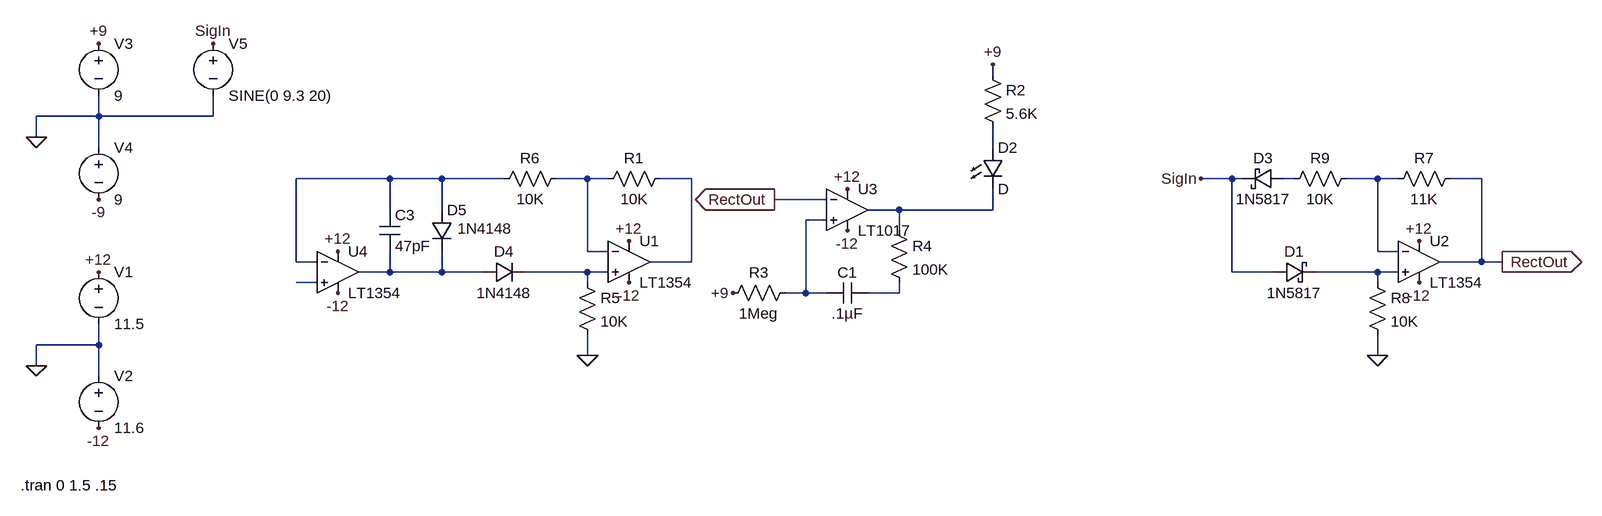
[diagram p0: schematic clip_detector.asc]
clip_detector.asc, the LTspice schematic file:
Version 4
SHEET 1 2008 1044
WIRE 1072 160 1072 144
WIRE -304 224 -304 192
WIRE -304 224 -400 224
WIRE -128 224 -128 192
WIRE -128 224 -304 224
WIRE -400 256 -400 224
WIRE -304 272 -304 224
WIRE 1072 272 1072 240
WIRE 144 320 0 320
WIRE 224 320 144 320
WIRE 320 320 224 320
WIRE 448 320 400 320
WIRE 480 320 448 320
WIRE 608 320 560 320
WIRE 1440 320 1392 320
WIRE 1456 320 1440 320
WIRE 1536 320 1520 320
WIRE 1664 320 1616 320
WIRE 1696 320 1664 320
WIRE 1824 320 1776 320
WIRE 816 352 736 352
WIRE 144 368 144 320
WIRE 224 368 224 320
WIRE 928 368 880 368
WIRE 1072 368 1072 336
WIRE 1072 368 928 368
WIRE 816 384 784 384
WIRE 928 400 928 368
WIRE 448 432 448 320
WIRE 480 432 448 432
WIRE 1664 432 1664 320
WIRE 1696 432 1664 432
WIRE 0 448 0 320
WIRE 32 448 0 448
WIRE 608 448 608 320
WIRE 608 448 544 448
WIRE 1824 448 1824 320
WIRE 1824 448 1760 448
WIRE 1856 448 1824 448
WIRE 144 464 144 432
WIRE 144 464 96 464
WIRE 224 464 224 432
WIRE 224 464 144 464
WIRE 288 464 224 464
WIRE 448 464 352 464
WIRE 480 464 448 464
WIRE 1440 464 1440 320
WIRE 1504 464 1440 464
WIRE 1664 464 1568 464
WIRE 1696 464 1664 464
WIRE 32 480 0 480
WIRE 448 480 448 464
WIRE 1664 480 1664 464
WIRE 784 496 784 384
WIRE 784 496 752 496
WIRE 816 496 784 496
WIRE 928 496 928 480
WIRE 928 496 880 496
WIRE -304 576 -304 544
WIRE -304 576 -400 576
WIRE 448 592 448 560
WIRE 1664 592 1664 560
WIRE -400 608 -400 576
WIRE -304 624 -304 576
FLAG -400 608 0
FLAG -304 464 +12
FLAG -304 704 -12
FLAG 848 336 +12
FLAG 848 400 -12
FLAG -400 256 0
FLAG -304 112 +9
FLAG -304 352 -9
FLAG -128 112 SigIn
FLAG 672 496 +9
FLAG 1072 144 +9
FLAG 512 416 +12
FLAG 512 480 -12
FLAG 448 592 0
FLAG 64 432 +12
FLAG 64 496 -12
FLAG 1728 416 +12
FLAG 1728 480 -12
FLAG 1664 592 0
FLAG 1392 320 SigIn
FLAG 1856 448 RectOut
IOPIN 1856 448 Out
FLAG 736 352 RectOut
IOPIN 736 352 Out
SYMBOL voltage -304 448 R0
WINDOW 123 0 0 Left 0
WINDOW 39 0 0 Left 0
SYMATTR InstName V1
SYMATTR Value 11.5
SYMBOL voltage -304 608 R0
WINDOW 123 0 0 Left 0
WINDOW 39 0 0 Left 0
SYMATTR InstName V2
SYMATTR Value 11.6
SYMBOL cap 880 480 R90
WINDOW 0 0 32 VBottom 2
WINDOW 3 32 32 VTop 2
SYMATTR InstName C1
SYMATTR Value .1µF
SYMBOL res 768 480 R90
WINDOW 0 0 56 VBottom 2
WINDOW 3 32 56 VTop 2
SYMATTR InstName R3
SYMATTR Value 1Meg
SYMBOL voltage -304 96 R0
WINDOW 123 0 0 Left 0
WINDOW 39 0 0 Left 0
SYMATTR InstName V3
SYMATTR Value 9
SYMBOL voltage -304 256 R0
WINDOW 123 0 0 Left 0
WINDOW 39 0 0 Left 0
SYMATTR InstName V4
SYMATTR Value 9
SYMBOL voltage -128 96 R0
WINDOW 123 0 0 Left 0
WINDOW 39 0 0 Left 0
SYMATTR InstName V5
SYMATTR Value SINE(0 9.3 20)
SYMBOL Comparators\\LT1017 848 368 R0
SYMATTR InstName U3
SYMBOL LED 1056 272 R0
SYMATTR InstName D2
SYMBOL res 1056 144 R0
SYMATTR InstName R2
SYMATTR Value 5.6K
SYMBOL diode 288 480 R270
WINDOW 0 32 32 VTop 2
WINDOW 3 0 32 VBottom 2
SYMATTR InstName D4
SYMATTR Value 1N4148
SYMBOL diode 208 368 R0
WINDOW 3 40 29 Left 2
SYMATTR Value 1N4148
SYMATTR InstName D5
SYMBOL OpAmps\\LT1354 512 384 R0
SYMATTR InstName U1
SYMBOL res 464 336 R270
WINDOW 0 32 56 VTop 2
WINDOW 3 0 56 VBottom 2
SYMATTR InstName R1
SYMATTR Value 10K
SYMBOL res 432 464 R0
SYMATTR InstName R5
SYMATTR Value 10K
SYMBOL OpAmps\\LT1354 64 400 R0
SYMATTR InstName U4
SYMBOL cap 128 368 R0
SYMATTR InstName C3
SYMATTR Value 47pF
SYMBOL res 304 336 R270
WINDOW 0 32 56 VTop 2
WINDOW 3 0 56 VBottom 2
SYMATTR InstName R6
SYMATTR Value 10K
SYMBOL res 912 384 R0
SYMATTR InstName R4
SYMATTR Value 100K
SYMBOL schottky 1504 480 R270
WINDOW 0 32 32 VTop 2
WINDOW 3 0 32 VBottom 2
SYMATTR InstName D1
SYMATTR Value 1N5817
SYMATTR Description Diode
SYMATTR Type diode
SYMBOL schottky 1520 304 R90
WINDOW 3 32 32 VTop 2
WINDOW 0 0 32 VBottom 2
SYMATTR Value 1N5817
SYMATTR InstName D3
SYMATTR Description Diode
SYMATTR Type diode
SYMBOL OpAmps\\LT1354 1728 384 R0
SYMATTR InstName U2
SYMBOL res 1680 336 R270
WINDOW 0 32 56 VTop 2
WINDOW 3 0 56 VBottom 2
SYMATTR InstName R7
SYMATTR Value 11K
SYMBOL res 1648 464 R0
SYMATTR InstName R8
SYMATTR Value 10K
SYMBOL res 1520 336 R270
WINDOW 0 32 56 VTop 2
WINDOW 3 0 56 VBottom 2
SYMATTR InstName R9
SYMATTR Value 10K
TEXT -424 792 Left 2 !.tran 0 1.5 .15

The netlist it stands for:
* clip_detector.asc
V1 +12 0 11.5
V2 0 -12 11.6
C1 N013 N008 .1µF
R3 N008 +9 1Meg
V3 +9 0 9
V4 0 -9 9
V5 SigIn 0 SINE(0 9.3 20)
XU3 N008 RectOut +12 -12 N007 LT1017  ; pins In+ In- V+ V- OUT
D2 N001 N007 D
R2 +9 N001 5.6K
D4 N009 N010 1N4148
D5 N002 N009 1N4148
XU1 N010 N003 +12 -12 N004 LT1354  ; pins In+ In- V+ V- OUT
R1 N003 N004 10K
R5 N010 0 10K
XU4 N012 N002 +12 -12 N009 LT1354  ; pins In+ In- V+ V- OUT
C3 N002 N009 47pF
R6 N002 N003 10K
R4 N007 N013 100K
D1 SigIn N011 1N5817
D3 N005 SigIn 1N5817
XU2 N011 N006 +12 -12 RectOut LT1354  ; pins In+ In- V+ V- OUT
R7 N006 RectOut 11K
R8 N011 0 10K
R9 N005 N006 10K
.model D D
.lib standard.dio
.tran 0 1.5 .15
.backanno
.end